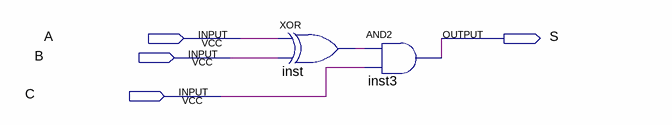
[diagram p0: schematic sheet]
// Quartus schematic PORTAS1.bdf as structural Verilog: 2 symbols, 4 pins
module PORTAS1 (
  input  A,
  input  B,
  input  C,
  output S
);

  wire inst_out;

  xor inst (inst_out, A, B);
  and inst3 (S, inst_out, C);
endmodule
